# EAGLE schematic Probe (EAGLE 9.5.1)

## Sheet 1 of 2
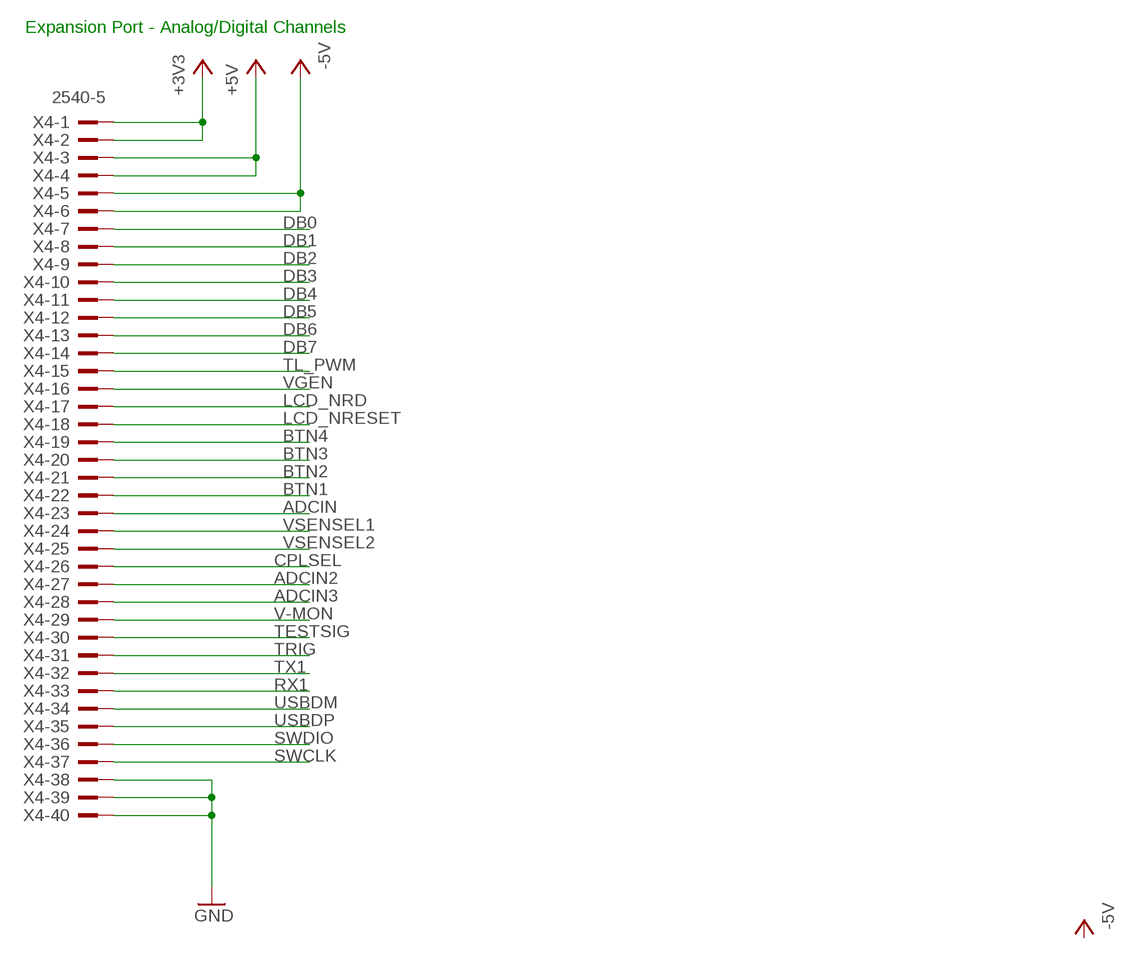
[diagram p0: schematic, sheet 1]

### Parts
X4  2540-5  [PAK100/2500-5-40]

### Nets
+3V3: X4.1 X4.2
+5V: X4.3 X4.4 ; also sheet 2
-5V: X4.5 X4.6 ; also sheet 2
ADCIN: X4.23 ; also sheet 2
ADCIN2: X4.27
ADCIN3: X4.28
BTN1: X4.22
BTN2: X4.21
BTN3: X4.20
BTN4: X4.19
CPLSEL: X4.26 ; also sheet 2
DB0: X4.7
DB1: X4.8
DB2: X4.9
DB3: X4.10
DB4: X4.11
DB5: X4.12
DB6: X4.13
DB7: X4.14
GND: X4.38 X4.39 X4.40 ; also sheet 2
LCD_NRD: X4.17
LCD_NRESET: X4.18
RX1: X4.33
SWCLK: X4.37
SWDIO: X4.36
TESTSIG: X4.30
TL_PWM: X4.15 ; also sheet 2
TRIG: X4.31 ; also sheet 2
TX1: X4.32
USBDM: X4.34
USBDP: X4.35
V-MON: X4.29
VGEN: X4.16
VSENSEL1: X4.24 ; also sheet 2
VSENSEL2: X4.25 ; also sheet 2

### Notes on the sheet
- Expansion Port - Analog/Digital Channels

## Sheet 2 of 2
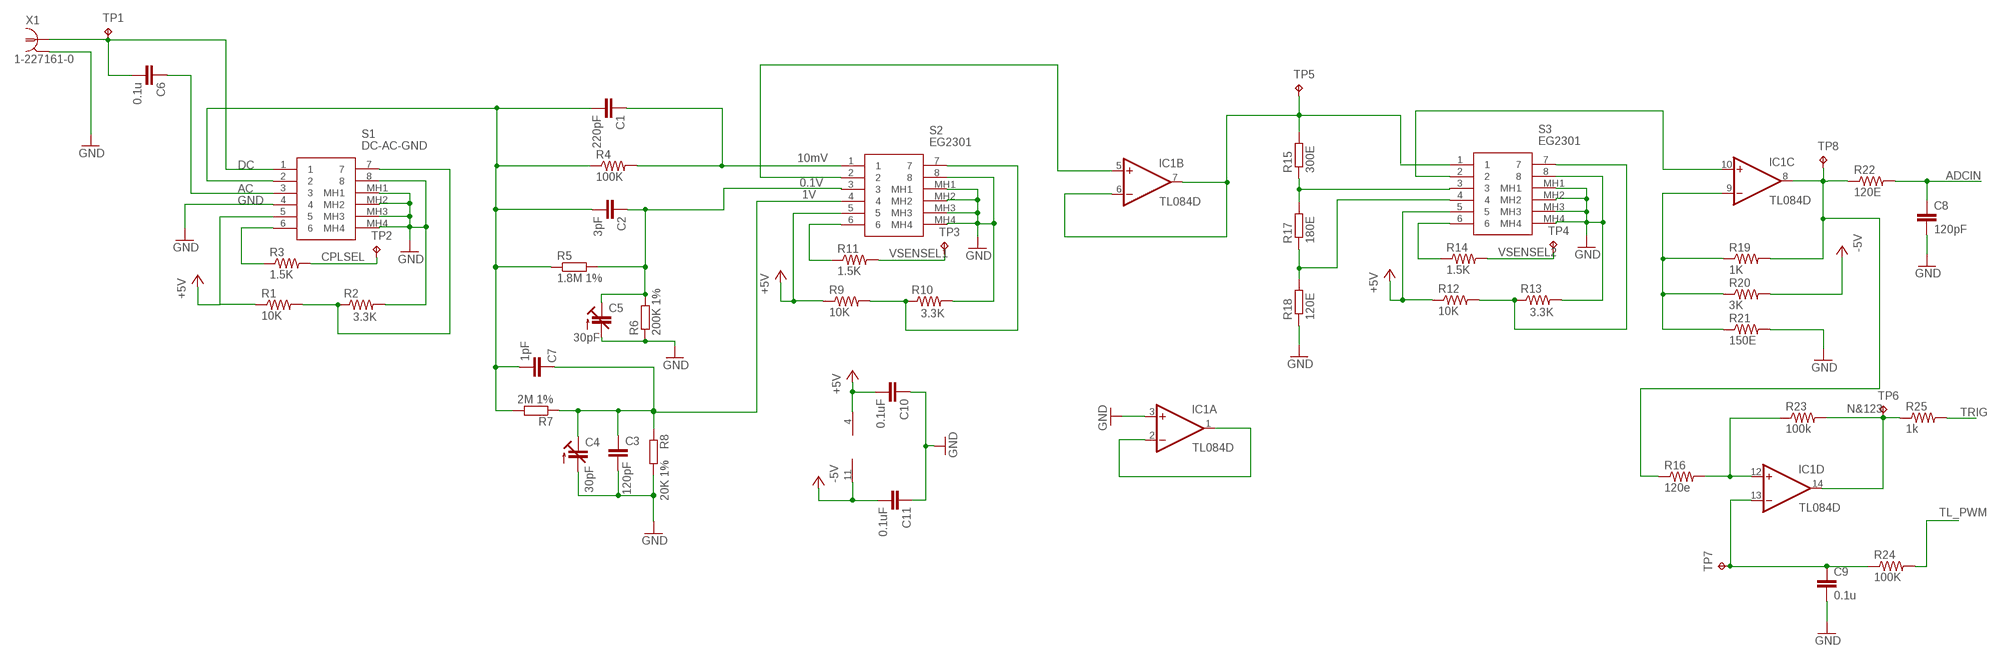
[diagram p1: schematic, sheet 2]

### Parts
C1  220pF  C-EUC1206  [C1206]
C2  3pF  C-EUC1206  [C1206]
C3  120pF  C2,5-3  [C2.5-3]
C4  30pF  C-TRIMM808  [CTRIM808-BC]
C5  30pF  C-TRIMM808  [CTRIM808-BC]
C6  0.1u  C-EUC1206  [C1206]
C7  1pF  C-EUC1206  [C1206]
C8  120pF  C2,5-3  [C2.5-3]
C9  0.1u  C2,5-3  [C2.5-3]
C10  0.1uF  C-EUC1206  [C1206]
C11  0.1uF  C-EUC1206  [C1206]
IC1  TL084D  [SO14]
R1  10K  R-US_R0805  [R0805]
R2  3.3K  R-US_R0805  [R0805]
R3  1.5K  R-US_R0805  [R0805]
R4  100K  R-US_R0805  [R0805]
R5  1.8M 1%  R-EU_0204/7  [0204/7]
R6  200K 1%  R-EU_0204/7  [0204/7]
R7  2M 1%  R-EU_0204/7  [0204/7]
R8  20K 1%  R-EU_0204/7  [0204/7]
R9  10K  R-US_R0805  [R0805]
R10  3.3K  R-US_R0805  [R0805]
R11  1.5K  R-US_R0805  [R0805]
R12  10K  R-US_R0805  [R0805]
R13  3.3K  R-US_R0805  [R0805]
R14  1.5K  R-US_R0805  [R0805]
R15  300E  R-EU_0204/7  [0204/7]
R16  120e  R-US_R0805  [R0805]
R17  180E  R-EU_0204/7  [0204/7]
R18  120E  R-EU_0204/7  [0204/7]
R19  1K  R-US_R0805  [R0805]
R20  3K  R-US_R0805  [R0805]
R21  150E  R-US_R0805  [R0805]
R22  120E  R-US_R0805  [R0805]
R23  100k  R-US_R0805  [R0805]
R24  100K  R-US_R0805  [R0805]
R25  1k  R-US_R0805  [R0805]
S1  DC-AC-GND  EG2301  [EG2301]
S2  EG2301  [EG2301]
S3  EG2301  [EG2301]
TP1  TPB1,27  [B1,27]
TP2  TPB1,27  [B1,27]
TP3  TPB1,27  [B1,27]
TP4  TPB1,27  [B1,27]
TP5  TPB1,27  [B1,27]
TP6  TPB1,27  [B1,27]
TP7  TPB1,27  [B1,27]
TP8  TPB1,27  [B1,27]
X1  1-227161-0  [AMP_227161]

### Nets
+5V: C10.2 IC1.4(P:V+) R1.1 R9.1 R12.1 S1.5 S2.5 S3.5 ; also sheet 1
-5V: C11.2 IC1.11(P:V-) R20.2 ; also sheet 1
ADCIN: C8.1 R22.2 ; also sheet 1
CPLSEL: R3.2 TP2.TP ; also sheet 1
GND: C3.2 C4.2(A) C5.2(A) C8.2 C9.2 C10.1 C11.1 IC1.3(A:+IN) R2.2 R6.1 R8.2 R10.2 R13.2 R18.1 R21.2 S1.4 S1.8 S1.MH1 S1.MH2 S1.MH3 S1.MH4 S2.8 S2.MH1 S2.MH2 S2.MH3 S2.MH4 S3.8 S3.MH1 S3.MH2 S3.MH3 S3.MH4 X1.2 ; also sheet 1
N$1: C6.2 S1.1 TP1.TP X1.1
N$2: C6.1 S1.3
N$3: R3.1 S1.6
N$4: R1.2 R2.1 S1.7
N$5: C1.2 C2.2 C7.2 R4.1 R5.1 R7.2 S1.2
N$6: C3.1 C4.1(E) C7.1 R7.1 R8.1 S2.4
N$7: C1.1 R4.2 S2.1
N$8: C2.1 C5.1(E) R5.2 R6.2 S2.3
N$9: IC1.5(B:+IN) S2.2
N$10: R15.1 R17.2 S3.3
N$11: R9.2 R10.1 S2.7
N$12: R11.1 S2.6
N$13: R12.2 R13.1 S3.7
N$14: R14.1 S3.6
N$15: IC1.6(B:-IN) IC1.7(B:OUT) R15.2 TP5.TP
N$16: IC1.10(C:+IN) S3.2
N$17: R17.1 R18.2 S3.4
N$19: S3.1
N$20: IC1.9(C:-IN) R19.1 R20.1 R21.1
N$21: IC1.1(A:OUT) IC1.2(A:-IN)
N$22: IC1.12(D:+IN) R16.2 R23.1
N$23: IC1.8(C:OUT) R16.1 R19.2 R22.1 TP8.TP
N$24: C9.1 IC1.13(D:-IN) R24.1 TP7.TP
N&123: IC1.14(D:OUT) R23.2 R25.1 TP6.TP
TL_PWM: R24.2 ; also sheet 1
TRIG: R25.2 ; also sheet 1
VSENSEL1: R11.2 TP3.TP ; also sheet 1
VSENSEL2: R14.2 TP4.TP ; also sheet 1

### Notes on the sheet
- 10mV
- DC
- 0.1V
- AC
- 1V
- GND

## Library data of the parts
C1 C2 C6 C7 C10 C11 = rcl:C-EU: CAPACITOR, European symbol; SPICEPREFIX: C
C3 C8 C9 = capacitor-wima:C: CAPACITOR naming: grid - package width
C4 C5 = rcl:C-TRIMM: Trimm capacitor; SPICEPREFIX: C
IC1 = linear:TL084: OP AMP; SPICEPREFIX: X
R1-R4 R9-R14 R16 R19-R25 = rcl:R-US_: RESISTOR, American symbol; SPICEPREFIX: R
R5-R8 R15 R17 R18 = rcl:R-EU_: RESISTOR, European symbol; SPICEPREFIX: R
S1-S3 = SamacSys_Parts:EG2301: Slide Switches DP3T PC MNT SLIDE Source: Datasheet <http://www.mouser.com/datasheet/2/140/EG-345873.pdf>; DESCRIPTION: Slide Switches DP3T PC MNT SLIDE; HEIGHT: 11mm; MANUFACTURER_NAME: E-Switch; MANUFACTURER_PART_NUMBER: EG2301; MOUSER_PART_NUMBER: 612-EG2301; MOUSER_PRICE-STOCK: https://www.mouser.co.uk/ProductDetail/E-Switch/EG2301?qs=6C6BR4UgC3MjpdLgLKoVKg%3D%3D
TP1-TP8 = testpad:TP: Test pad
X1 = con-coax:?227161*: JACK, RIGHT ANGLE, 50 OHM, PCB, BNC Source: amp_227161.pdf; MF: TYCO ELECTRONICS; MPN: 1-227161; OC_FARNELL: unknown; OC_NEWARK: 33B3200
X4 = con-3m:2540-: 3M (TM) Pak 100 4-Wall Header Source: 3M; OC_FARNELL: 9838414; OC_NEWARK: unknown